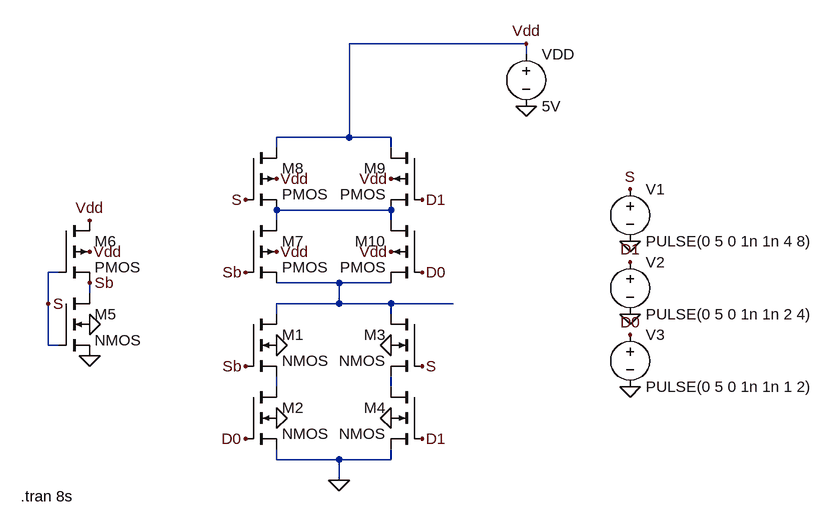
[diagram p0: schematic Multiplexar_Comp_CMOS.asc]
Multiplexar_Comp_CMOS.asc, the LTspice schematic file:
Version 4
SHEET 1 1016 680
WIRE 560 -272 288 -272
WIRE 560 -256 560 -272
WIRE 288 -128 288 -272
WIRE 288 -128 176 -128
WIRE 352 -128 288 -128
WIRE 176 -112 176 -128
WIRE 352 -112 352 -128
WIRE 352 -16 176 -16
WIRE 176 0 176 -16
WIRE 352 0 352 -16
WIRE -160 80 -176 80
WIRE 272 96 176 96
WIRE 352 96 272 96
WIRE -112 112 -112 96
WIRE -176 128 -176 80
WIRE 272 128 272 96
WIRE 272 128 176 128
WIRE 352 128 272 128
WIRE 448 128 352 128
WIRE 176 144 176 128
WIRE 352 144 352 128
WIRE -176 192 -176 128
WIRE -160 192 -176 192
WIRE 176 256 176 240
WIRE 352 256 352 240
WIRE 176 368 176 352
WIRE 272 368 176 368
WIRE 352 368 352 352
WIRE 352 368 272 368
WIRE 272 400 272 368
FLAG 272 400 0
FLAG -112 208 0
FLAG 560 -176 0
FLAG 720 32 0
FLAG 720 144 0
FLAG 720 256 0
FLAG 560 -272 Vdd
FLAG 176 -64 Vdd
FLAG 352 -64 Vdd
FLAG 176 48 Vdd
FLAG 352 48 Vdd
FLAG -112 48 Vdd
FLAG -112 0 Vdd
FLAG -112 160 0
FLAG 176 192 0
FLAG 352 192 0
FLAG 176 304 0
FLAG 352 304 0
FLAG 720 -48 S
FLAG 400 80 D0
FLAG 128 336 D0
FLAG 720 176 D0
FLAG -176 128 S
FLAG 128 -32 S
FLAG 400 224 S
FLAG -112 96 Sb
FLAG 128 80 Sb
FLAG 128 224 Sb
FLAG 720 64 D1
FLAG 400 -32 D1
FLAG 400 336 D1
SYMBOL nmos4 128 144 R0
SYMATTR InstName M1
SYMBOL nmos4 128 256 R0
SYMATTR InstName M2
SYMBOL nmos4 400 144 M0
SYMATTR InstName M3
SYMBOL nmos4 400 256 M0
SYMATTR InstName M4
SYMBOL nmos4 -160 112 R0
SYMATTR InstName M5
SYMBOL pmos4 -160 0 R0
SYMATTR InstName M6
SYMBOL pmos4 128 0 R0
SYMATTR InstName M7
SYMBOL pmos4 128 -112 R0
SYMATTR InstName M8
SYMBOL pmos4 400 -112 M0
SYMATTR InstName M9
SYMBOL pmos4 400 0 M0
SYMATTR InstName M10
SYMBOL voltage 720 -64 R0
WINDOW 123 0 0 Left 0
WINDOW 39 0 0 Left 0
SYMATTR InstName V1
SYMATTR Value PULSE(0 5 0 1n 1n 4 8)
SYMBOL voltage 720 48 R0
SYMATTR InstName V2
SYMATTR Value PULSE(0 5 0 1n 1n 2 4)
SYMBOL voltage 720 160 R0
SYMATTR InstName V3
SYMATTR Value PULSE(0 5 0 1n 1n 1 2)
SYMBOL voltage 560 -272 R0
SYMATTR InstName VDD
SYMATTR Value 5V
TEXT -218 424 Left 2 !.tran 8s

The netlist it stands for:
* Multiplexar_Comp_CMOS.asc
M1 N002 Sb N003 0 NMOS
M2 N003 D0 0 0 NMOS
M3 N002 S N004 0 NMOS
M4 N004 D1 0 0 NMOS
M5 Sb S 0 0 NMOS
M6 Vdd S Sb Vdd PMOS
M7 N001 Sb N002 Vdd PMOS
M8 Vdd S N001 Vdd PMOS
M9 Vdd D1 N001 Vdd PMOS
M10 N001 D0 N002 Vdd PMOS
V1 S 0 PULSE(0 5 0 1n 1n 4 8)
V2 D1 0 PULSE(0 5 0 1n 1n 2 4)
V3 D0 0 PULSE(0 5 0 1n 1n 1 2)
VDD Vdd 0 5V
.model NMOS NMOS
.model PMOS PMOS
.lib standard.mos
.tran 8s
.backanno
.end

* Results of the author's LTspice run, read from the files saved beside the schematic
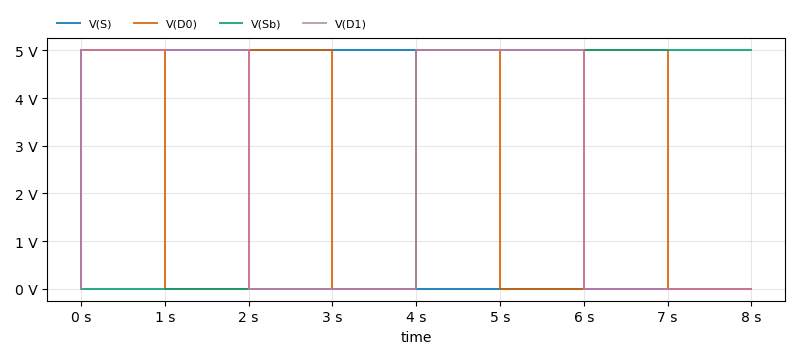
[diagram p1: Transient Analysis of Multiplexar_Comp_CMOS.asc, plotted from the saved traces]
* Transient Analysis, 1 run:
*   V(S): min 0 V, max 5 V, average 2.5 V, rms 3.536 V, last 0 V
*   V(D0): min 0 V, max 5 V, average 2.5 V, rms 3.536 V, last 0 V
*   V(Sb): min 0 V, max 5 V, average 2.5 V, rms 3.536 V, last 5 V
*   V(D1): min 0 V, max 5 V, average 2.5 V, rms 3.536 V, last 0 V